# EAGLE design overview_mcu_dev (EAGLE 9.2.2)
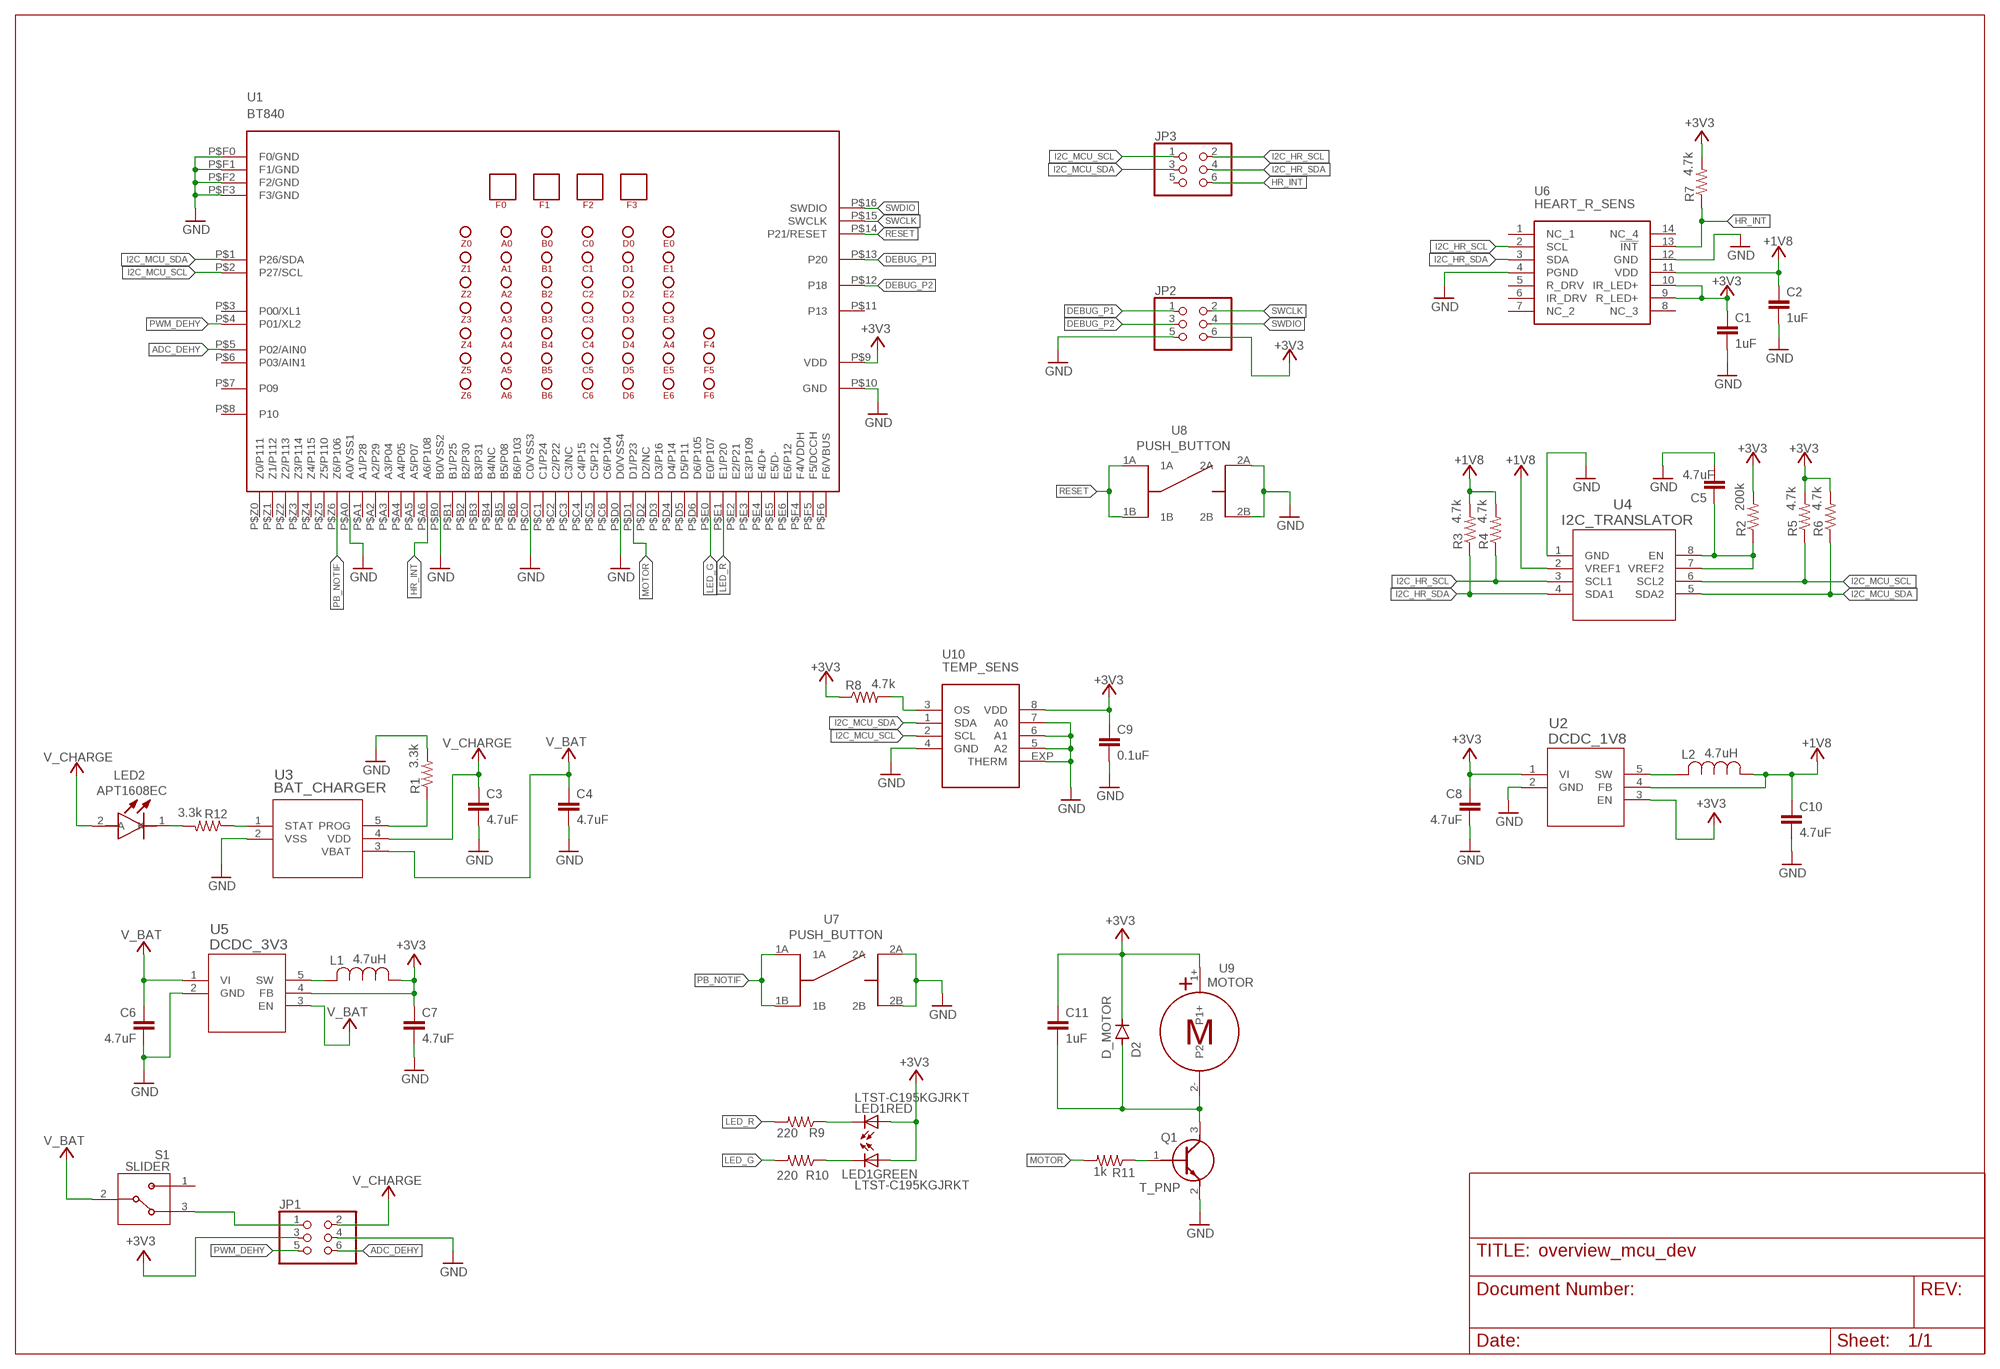
[diagram p0: schematic, sheet 1]

## Parts
C1  1uF  C-EUC0402K  [C0402K]
C2  1uF  C-EUC0402K  [C0402K]
C3  4.7uF  C-EUC0402K  [C0402K]
C4  4.7uF  C-EUC0402K  [C0402K]
C5  4.7uF  C-EUC0402K  [C0402K]
C6  4.7uF  C-EUC0402K  [C0402K]
C7  4.7uF  C-EUC0402K  [C0402K]
C8  4.7uF  C-EUC0402K  [C0402K]
C9  0.1uF  C-EUC0402K  [C0402K]
C10  4.7uF  C-EUC0402K  [C0402K]
C11  1uF  C-EUC0402K  [C0402K]
D2  D_MOTOR  CGRM4001-G  [SOD-123_MINI-SMA]
JP1  PINHD-2X3  [2X03]
JP2  PINHD-2X3  [2X03]
JP3  PINHD-2X3  [2X03]
L1  4.7uH  L_0604  [IND_1608]
L2  4.7uH  L_0604  [IND_1608]
LED1  LTST-C195KGJRKT  [LED-SMT]
LED2  APT1608EC  [LEDC1608X85N]
Q1  T_PNP  [SOT95P240X93-3N]
R1  3.3k  R-US_R0402  [R0402]
R2  200k  R-US_R0402  [R0402]
R3  4.7k  R-US_R0402  [R0402]
R4  4.7k  R-US_R0402  [R0402]
R5  4.7k  R-US_R0402  [R0402]
R6  4.7k  R-US_R0402  [R0402]
R7  4.7k  R-US_R0402  [R0402]
R8  4.7k  R-US_R0402  [R0402]
R9  220  R-US_R0402  [R0402]
R10  220  R-US_R0402  [R0402]
R11  1k  R-US_R0402  [R0402]
R12  3.3k  R-US_R0402  [R0402]
S1  SLIDER  [SW_CJS-1200TA]
U1  BT840  [BT840]
U2  DCDC_1V8  [DBV5]
U3  BAT_CHARGER  [SOT-23-5_MC]
U4  I2C_TRANSLATOR  [DQE8]
U5  DCDC_3V3  [DBV5]
U6  HEART_R_SENS  [MAX30102]
U7  PUSH_BUTTON  [PUSH_BUTTON]
U8  PUSH_BUTTON  [PUSH_BUTTON]
U9  MOTOR  [MOTOR]
U10  TEMP_SENS  [MAX30205]

## Nets
+1V8: C2.1 C10.1 L2.1 R3.2 R4.2 U2.4(FB) U4.2(VREF1) U6.11(VDD)
+3V3: C1.1 C7.1 C8.1 C9.1 C11.1 D2.C JP1.3 JP2.6 L1.1 LED1.P$1(GREEN:A) LED1.P$2(RED:A) R2.2 R5.2 R6.2 R7.2 R8.1 U1.P$9(VDD) U2.1(VI) U2.3(EN) U5.4(FB) U6.9(R_LED+) U6.10(IR_LED+) U9.1+ U10.8(VDD)
ADC_DEHY: JP1.6 U1.P$5(P02/AIN0)
DEBUG_P1: JP2.1 U1.P$13(P20)
DEBUG_P2: JP2.3 U1.P$12(P18)
GND: C1.2 C2.2 C3.2 C4.2 C5.2 C6.2 C7.2 C8.2 C9.2 C10.2 JP1.4 JP2.5 Q1.2(E) R1.2 U1.P$10(GND) U1.P$A0(A0/VSS1) U1.P$B0(B0/VSS2) U1.P$C0(C0/VSS3) U1.P$D0(D0/VSS4) U1.P$F0(F0/GND) U1.P$F1(F1/GND) U1.P$F2(F2/GND) U1.P$F3(F3/GND) U2.2(GND) U3.2(VSS) U4.1(GND) U5.2(GND) U6.4(PGND) U6.12(GND) U7.2A U7.2B U8.2A U8.2B U10.4(GND) U10.5(A2) U10.6(A1) U10.7(A0) U10.EXP(THERM)
HR_INT: JP3.6 R7.1 U1.P$A6(A6/P108) U6.13(!INT)
I2C_HR_SCL: JP3.2 R4.1 U4.3(SCL1) U6.2(SCL)
I2C_HR_SDA: JP3.4 R3.1 U4.4(SDA1) U6.3(SDA)
I2C_MCU_SCL: JP3.1 R5.1 U1.P$2(P27/SCL) U4.6(SCL2) U10.2(SCL)
I2C_MCU_SDA: JP3.3 R6.1 U1.P$1(P26/SDA) U4.5(SDA2) U10.1(SDA)
LED_G: R10.2 U1.P$E0(E0/P107)
LED_R: R9.2 U1.P$E1(E1/P20)
MOTOR: R11.2 U1.P$D1(D1/P23)
N$1: JP1.1 S1.3
N$2: R1.1 U3.5(PROG)
N$3: C5.1 R2.1 U4.7(VREF2) U4.8(EN)
N$4: L1.2 U5.5(SW)
N$5: L2.2 U2.5(SW)
N$6: LED1.P$4(RED:C) R9.1
N$7: R8.2 U10.3(OS)
N$8: LED1.P$3(GREEN:C) R10.1
N$9: R12.1 U3.1(STAT)
N$10: LED2.1(K) R12.2
N$11: C11.2 D2.A Q1.3(C) U9.2-
N$12: Q1.1(B) R11.1
PB_NOTIF: U1.P$Z6(Z6/P106) U7.1A U7.1B
PWM_DEHY: JP1.5 U1.P$4(P01/XL2)
RESET: U1.P$14(P21/RESET) U8.1A U8.1B
SWCLK: JP2.2 U1.P$15(SWCLK)
SWDIO: JP2.4 U1.P$16(SWDIO)
V_BAT: C4.1 C6.1 S1.2 U3.3(VBAT) U5.1(VI) U5.3(EN)
V_CHARGE: C3.1 JP1.2 LED2.2(A) U3.4(VDD)
Unconnected: JP3.5 S1.1 U1.P$3(P00/XL1) U1.P$6(P03/AIN1) U1.P$7(P09) U1.P$8(P10) U1.P$11(P13) U1.P$A1(A1/P28) U1.P$A2(A2/P29) U1.P$A3(A3/P04) U1.P$A4(A4/P05) U1.P$A5(A5/P07) U1.P$B1(B1/P25) U1.P$B2(B2/P30) U1.P$B3(B3/P31) U1.P$B4(B4/NC) U1.P$B5(B5/P08) U1.P$B6(B6/P103) U1.P$C1(C1/P24) U1.P$C2(C2/P22) U1.P$C3(C3/NC) U1.P$C4(C4/P15) U1.P$C5(C5/P12) U1.P$C6(C6/P104) U1.P$D2(D2/NC) U1.P$D3(D3/P16) U1.P$D4(D4/P14) U1.P$D5(D5/P11) U1.P$D6(D6/P105) U1.P$E2(E2/P21) U1.P$E3(E3/P109) U1.P$E4(E4/D+) U1.P$E5(E5/D-) U1.P$E6(E6/P12) U1.P$F4(F4/VDDH) U1.P$F5(F5/DCCH) U1.P$F6(F6/VBUS) U1.P$Z0(Z0/P111) U1.P$Z1(Z1/P112) U1.P$Z2(Z2/P113) U1.P$Z3(Z3/P114) U1.P$Z4(Z4/P115) U1.P$Z5(Z5/P110) U6.1(NC_1) U6.5(R_DRV) U6.6(IR_DRV) U6.7(NC_2) U6.8(NC_3) U6.14(NC_4)

## Library data of the parts
C1-C11 = resistor:C-EU: CAPACITOR, European symbol
D2 = diode:CGRM400*-G: Molded plasitc,JEDEC SOD-123/Mini SMA Source: Comchip CGRM4001-G.pdf
JP1-JP3 = pinhead:PINHD-2X3: PIN HEADER
L1 L2 = L_0604:L_0604; MANUFACTURER_PART_NUMBER: GLFR1608T4R7MLR; VENDOR: TDK
LED1 = Led_LTST-C195KGJRKT:LTST-C195KGJRKT; DESCRIPTION: LED GREEN/RED CLEAR CHIP SMD; LINK: https://www.digikey.com/product-detail/en/lite-on-inc/LTST-C195KGJRKT/160-1452-1-ND/386846; MANUFACTURER: Lite-On Inc.; MANUFACTURER_PART_NUM: LTST-C195KGJRKT
LED2 = LED_APT1608EC:APT1608EC: Standard LEDs - SMD HI EFF RED WTR CLR Source: Datasheet <http://docs-emea.rs-online.com/webdocs/142e/0900766b8142ead4.pdf>; DESCRIPTION: LED RED CLEAR CHIP SMD; LINK: https://www.digikey.com/product-detail/en/kingbright/APT1608EC/754-1117-1-ND/1747834; MANUFACTURER: Kingbright; MANUFACTURER_PART_NUM: APT1608EC
Q1 = transistor:T_PNP: Transistor GP BJT NPN 40V 0.2A SOT23 Fairchild MMBT3904 NPN Bipolar Transistor, 0.2 A, 40 V, 3-Pin SOT-23 Source: Datasheet <https://www.fairchildsemi.com/datasheets/MM/MMBT3904.pdf>; DESCRIPTION: TRANS NPN 40V 0.2A SOT23; LINK: https://www.digikey.com/products/en?keywords=MMBT3904TPMSCT; MANUFACTURER: Micro Commercial Co; MANUFACTURER_PART_NUM: MMBT3904-TP
R1-R12 = resistor:R-US_: RESISTOR, American symbol
S1 = slider:SLIDER: Switch Slide N.O./N.C. SPDT Raised Slide 0.1A 24VDC J-Hook SMD Embossed T/R; DESCRIPTION: SWITCH SLIDE SPDT 100MA 6V; LINK: https://www.digikey.com/product-detail/en/nidec-copal-electronics/CJS-1200TA/563-1021-1-ND/948401; MANUFACTURER: Nidec Copal Electronics; MANUFACTURER_PART: CJS-1200TA
U1 = Nrf52_BT840:BT840; DESCRIPTION: NRF52840 BLUETOOTH 5, THREAD, ZI; LINK: https://www.fanstel.com/bt840f-nrf52840-ble-5-module-secure-iot-802154-thread-zigbee; MANUFACTURER: Fanstel; MANUFACTURER_PART_NUM: BT840
U2 = DCDC_1V8_TPS62202DBVR:DCDC_1V8; DESCRIPTION: IC REG BUCK 1.8V 0.3A SYNC SOT23; LINK: https://www.digikey.com/product-detail/en/texas-instruments/TPS62202DBVR/296-16730-1-ND/616311; MANUFACTURER: Texas Instruments; MANUFACTURER_PART_NUM: TPS62202DBVR
U3 = BatManager_MCP73831:BAT_CHARGER; DESCRIPTION: IC CONTROLLR LI-ION 4.2V SOT23-5; LINK: https://www.digikey.com/product-detail/en/microchip-technology/MCP73831T-2ACI-OT/MCP73831T-2ACI-OTCT-ND/1979802; MANUFACTURER: Microchip; MANUFACTURER_PART_NUM: MCP73831T2ACIOT
U4 = I2Ctranslator_PCA9306DQER:I2C_TRANSLATOR; DESCRIPTION: IC TRNSLTR BIDIRECTIONAL 8X2SON; LINK: https://www.digikey.com/product-detail/en/texas-instruments/PCA9306DQER/296-27957-1-ND/2446266; MANUFACTURER: Texas Instruments; MANUFACTURER_PART_NUM: PCA9306DQER
U5 = DCDC_3V3_TPS62203DBVR:DCDC_3V3; DESCRIPTION: IC REG BUCK 3.3V 0.3A SYNC SOT23; LINK: https://www.digikey.com/product-detail/en/texas-instruments/TPS62203DBVR/296-39452-1-ND/5143400; MANUFACTURER: Texas Instruments; MANUFACTURER_PART_NUM: TPS62203DBVR
U6 = heartRate_max30102:HEART_R_SENS; DESCRIPTION: IC SENSOR OXIMETER/HEARTRATE; LINK: https://www.digikey.com/product-detail/en/maxim-integrated/MAX30102EFD/MAX30102EFD-ND/6166869; MANUFACTURER: Maxim Integrated; MANUFACTURER_PART_NUM: MAX30102EFD+
U7 U8 = push_button:PUSH_BUTTON; DESCRIPTION: SWITCH TACTILE SPST-NO 0.05A 12V; LINK: https://www.digikey.com/product-detail/en/panasonic-electronic-components/EVQ-P7A01P/P16763CT-ND/4429456; MANUFACTURER: Panasonic Electronic Components; MANUFACTURER_PART_NUM: EVQ-P7A01P
U9 = motor:MOTOR; DESCRIPTION: VIBRATION MOTOR CYL 2.7V SMD; LINK: https://www.digikey.com/product-detail/en/jinlong-machinery-electronics-inc/Z4FC1B1301781/1670-1011-1-ND/6009936; MANUFACTURER: Jinlong Machinery & Electronics, Inc.; MANUFACTURER_PART_NUM: Z4FC1B1301781
U10 = temp_max30205:TEMP_SENS; DESCRIPTION: SWITCH TACTILE SPST-NO 0.05A 12V; LINK: https://www.digikey.com/product-detail/en/panasonic-electronic-components/EVQ-P7A01P/P16763TR-ND/4429447; MANUFACTURER: Maxim Integrated; MANUFACTURER_PART_NUM: MAX30205MTA+

## Board
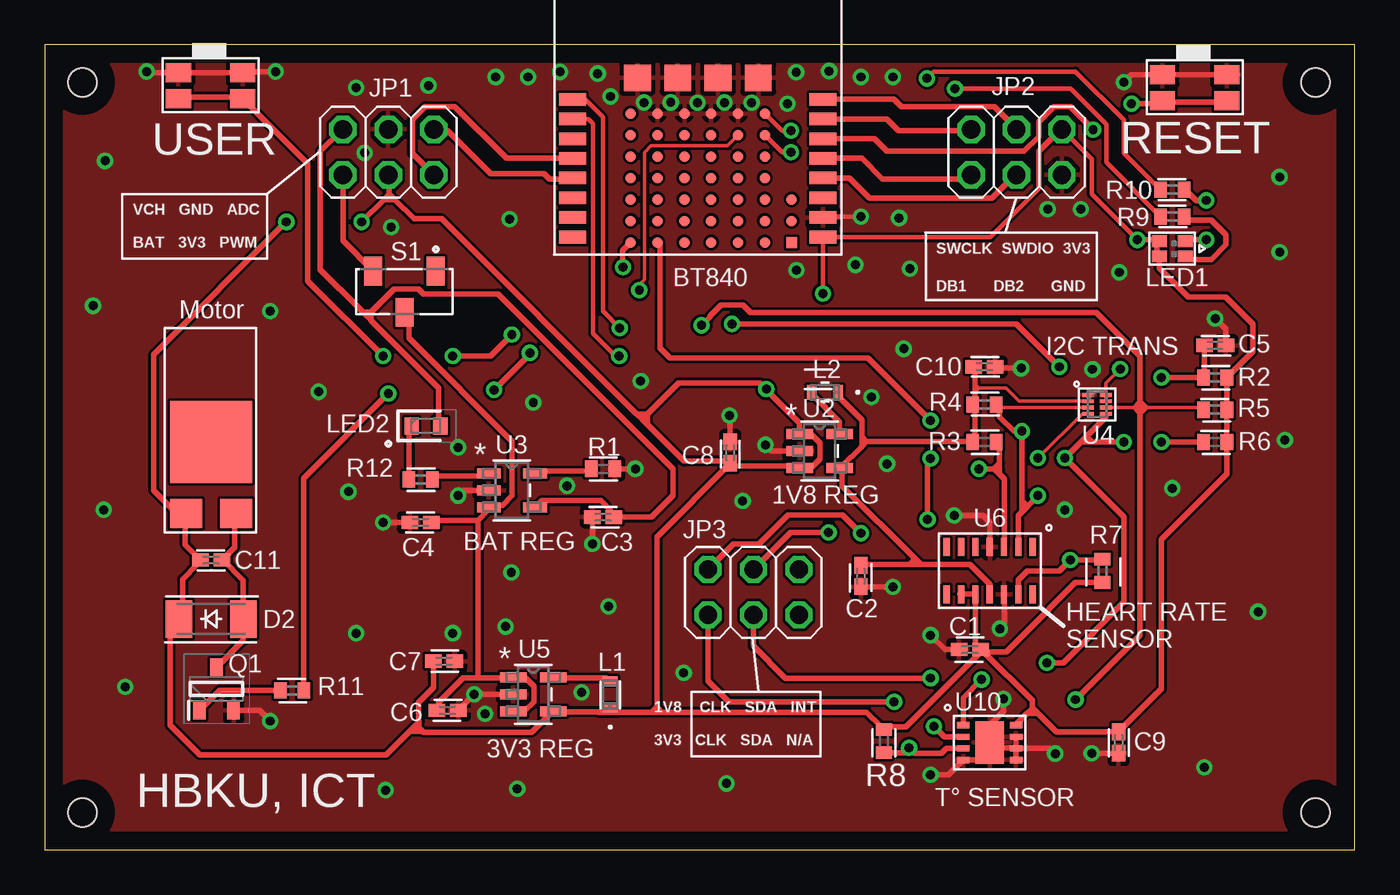
[diagram p1: board, top side]
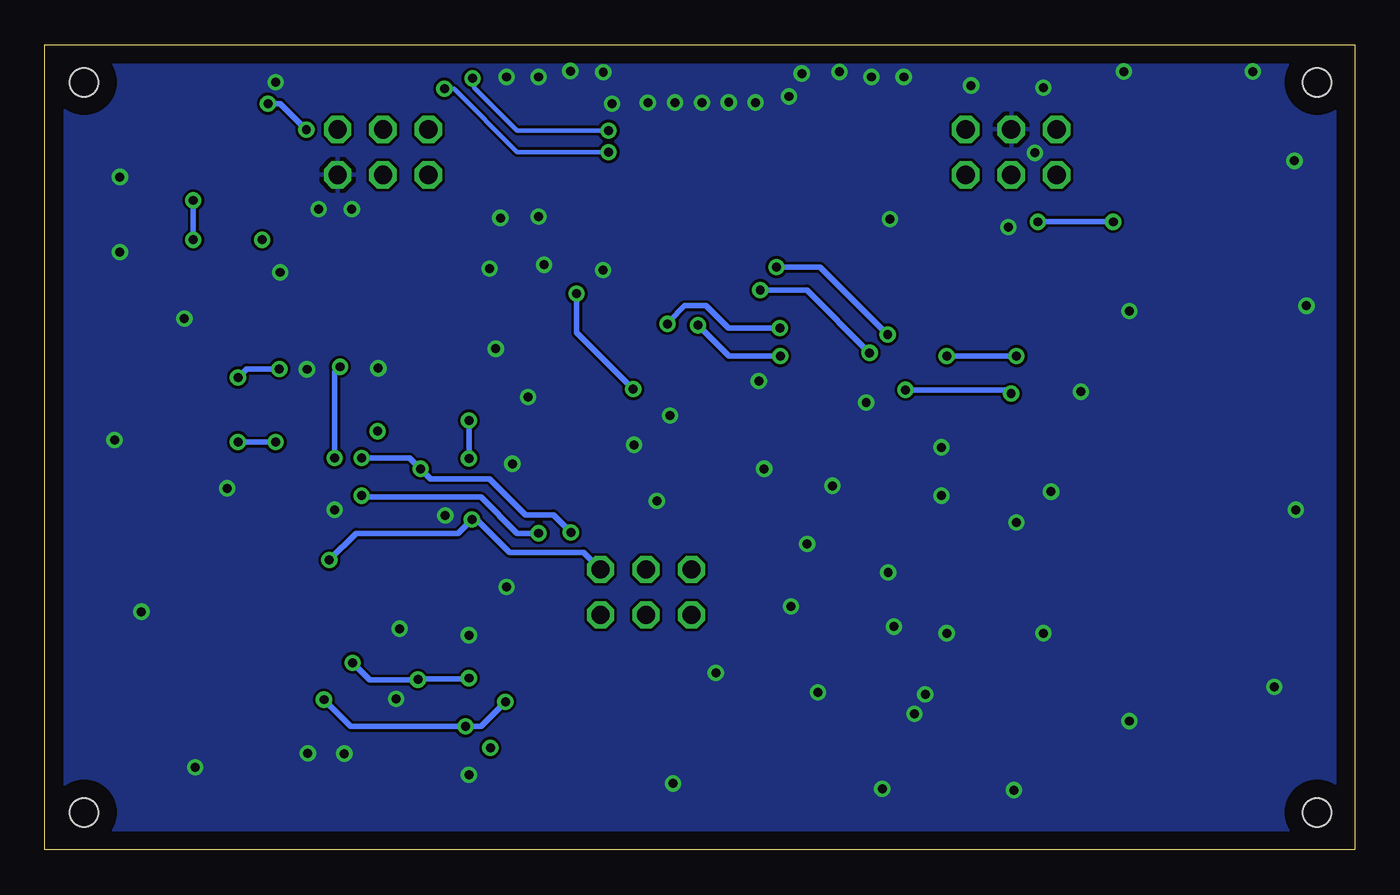
[diagram p2: board, bottom side, seen from below]

Size 73.2 x 45 mm. Coordinates in mm from the lower left corner, seen from the top.
Outline: 0,0 73.2,0 73.2,45 0,45 0,0
Copper layers (1*16): Top 0.035mm / dielectric 1.5mm / Bottom 0.035mm
Design rules "default *": minimum track width 0.15mm, minimum drill 0.5mm, track to track 6mil, track to pad 6mil, pad to pad 6mil, via to via 6mil, smd to smd 6mil, copper to edge 40mil, drill to drill 6mil, minimum pad ring 10mil, minimum via ring 8mil, stop-mask expansion 6mil, vias tented up to drill 0mil, thermal gap 10mil
Holes 1.6 mm at 2.1,42.9 2.1,2.1 71,42.9 71,2.1

### Footprints (pad centres in the part's own frame; a part is rotated, then mirrored left to right if it is on the bottom)
C0402K = smd 0.925 x 0.74: 1 -0.6,0; 2 0.6,0
SOD-123_MINI-SMA = smd 1.5 x 2.1: A 1.8,0; C -1.8,0
2X03 = drill 1.016 octagon: 1 -2.54,-1.27; 2 -2.54,1.27; 3 0,-1.27; 4 0,1.27; 5 2.54,-1.27; 6 2.54,1.27
IND_1608 = smd 0.503 x 0.8: 1 -0.752,0; 2 0.752,0
LED-SMT = smd 0.65 x 0.85: P$1 0.425,0.725; P$2 -0.425,0.725; P$3 0.425,-0.725; P$4 -0.425,-0.725
LEDC1608X85N = smd 0.8 x 0.95: 1 -0.8,0; 2 0.8,0
SOT95P240X93-3N = smd 1 x 0.7: 1 -1.2,0.95; 2 -1.2,-0.95; 3 1.2,0
R0402 = smd 0.7 x 0.9: 1 -0.65,0; 2 0.65,0
SW_CJS-1200TA = smd 1 x 1.6: 1 -1.75,-1.15; 2 0,1.15; 3 1.75,-1.15
BT840 = smd 1.5 x 0.7: P$1 -7.112,3.847; P$2 -7.112,2.747; P$3 -7.112,1.647; P$4 -7.112,0.547; P$5 -7.112,-0.553; P$6 -7.112,-1.653; P$7 -7.112,-2.753; P$8 -7.112,-3.853; P$9 6.888,-3.853; P$10 6.888,-2.753; P$11 6.888,-1.653; P$12 6.888,-0.553; P$13 6.888,0.547; P$14 6.888,1.647; P$15 6.888,2.747; P$16 6.888,3.847 | smd 0.6 x 0.6: P$A0 -2.362,3.047; P$A1 -2.362,1.847; P$A2 -2.362,0.647; P$A3 -2.362,-0.553; P$A4 -2.362,-1.753; P$A5 -2.362,-2.953; P$A6 -2.362,-4.153; P$B0 -0.862,3.047; P$B1 -0.862,1.847; P$B2 -0.862,0.647; P$B3 -0.862,-0.553; P$B4 -0.862,-1.753; P$B5 -0.862,-2.953; P$B6 -0.862,-4.153; P$C0 0.638,3.047; P$C1 0.638,1.847; P$C2 0.638,0.647; P$C3 0.638,-0.553; P$C4 0.638,-1.753; P$C5 0.638,-2.953; P$C6 0.638,-4.153; P$D0 2.138,3.047; P$D1 2.138,1.847; P$D2 2.138,0.647; P$D3 2.138,-0.553; P$D4 2.138,-1.753; P$D5 2.138,-2.953; P$D6 2.138,-4.153; P$E0 3.638,3.047; P$E1 3.638,1.847; P$E2 3.638,0.647; P$E3 3.638,-0.553; P$E4 3.638,-1.753; P$E5 3.638,-2.953; P$E6 3.638,-4.153; P$F4 5.138,-1.753; P$F5 5.138,-2.953; P$F6 5.138,-4.153; P$Z0 -3.862,3.047; P$Z1 -3.862,1.847; P$Z2 -3.862,0.647; P$Z3 -3.862,-0.553; P$Z4 -3.862,-1.753; P$Z5 -3.862,-2.953; P$Z6 -3.862,-4.153 | smd 1.5 x 1.5: P$F0 -3.482,5.047; P$F1 -1.232,5.047; P$F2 1.018,5.047; P$F3 3.268,5.047
DBV5 = smd 1.473 x 0.559: 1 -1.118,0.95; 2 -1.118,0; 3 -1.118,-0.95; 4 1.118,-0.95; 5 1.118,0.95
SOT-23-5_MC = smd 1.321 x 0.559: 1 -1.295,0.95; 2 -1.295,0; 3 -1.295,-0.95; 4 1.295,-0.95; 5 1.295,0.95
DQE8 = smd 0.66 x 0.203: 1 -0.495,0.525; 2 -0.495,0.175; 3 -0.495,-0.175; 4 -0.495,-0.525; 5 0.495,-0.525; 6 0.495,-0.175; 7 0.495,0.175; 8 0.495,0.525
MAX30102 = smd 1 x 0.35: 1 -1.325,2.4; 2 -1.325,1.6; 3 -1.325,0.8; 4 -1.325,0; 5 -1.325,-0.8; 6 -1.325,-1.6; 7 -1.325,-2.4; 8 1.325,-2.4; 9 1.325,-1.6; 10 1.325,-0.8; 11 1.325,0; 12 1.325,0.8; 13 1.325,1.6; 14 1.325,2.4
PUSH_BUTTON = smd 1.4 x 1.05: 1A -1.859,0.721; 1B 1.741,0.721; 2A -1.859,-0.729; 2B 1.741,-0.729
MOTOR = smd 1.8 x 1.6: 1+ -1.402,-3.996; 2- 1.4,-3.996 | smd 4.6 x 4.6: 3 0,0
MAX30205 = smd 0.7 x 0.35: 1 -1.475,0.975; 2 -1.475,0.325; 3 -1.475,-0.325; 4 -1.475,-0.975; 5 1.475,-0.975; 6 1.475,-0.325; 7 1.475,0.325; 8 1.475,0.975 | smd 1.58 x 2.35: EXP 0,0

### Placement (x,y rotation side)
C1  51.69,11.2 180 top
C2  45.6,15.3 270 top
C3  31.2,18.6 180 top
C4  21,18.3 180 top
C5  65.4,28.2 0 top
C6  22.5,7.8 0 top
C7  22.31,10.55 0 top
C8  38.3,22.2 90 top
C9  60,6 270 top
C10  52.5,27 0 top
C11  9.3,16.2 0 top
D2  9.3,12.9 0 top
JP1  19.2,39 0 top
JP2  54.3,39 0 top
JP3  39.6,14.4 0 top
L1  31.6,8.7 90 top
L2  43.6,25.58 180 top
LED1  63,33.6 90 top
LED2  21.3,23.7 0 top
Q1  9.6,9 90 top
R1  31.2,21.3 0 top
R2  65.4,26.4 0 top
R3  52.5,22.8 180 top
R4  52.5,24.9 180 top
R5  65.4,24.6 0 top
R6  65.4,22.8 0 top
R7  59.1,15.6 270 top
R8  46.89,6.08 270 top
R9  63,35.4 180 top
R10  63,36.9 180 top
R11  13.82,8.92 0 top
R12  21,20.7 180 top
S1  20.1,31.2 180 top
U1  36.6,38.1 0 top
U2  43.3,22.3 0 top
U3  26.1,20.1 0 top
U4  58.8,24.9 0 top
U5  27.3,8.7 0 top
U6  52.8,15.6 270 top
U7  9.21,42.71 180 top
U8  64.2,42.6 180 top
U9  9.3,22.8 0 top
U10  52.8,6 0 top

### Tracks (layer width: path | path; a pad name or v marks a point on that pad's centre or on a via)
+1V8
  Top 0.2: 51.98,26.1 51.98,26.02 52.2,25.8 51.98,25.57 51.98,25.55
  Top 0.203: 51.98,25.8 52.2,25.8 53.7,25.8 54.42,25.08 57.86,25.08 57.86,25.07 U4.2
  Top 0.3: C10.1 51.98,26.95 51.98,26.1 51.98,25.8 51.98,25.55 51.98,25.02 R4.2 51.98,24.75 51.98,22.82 R3.2 51.7,22.82 45.9,22.82 45.65,22.82 | 45.65,22.82 45.65,22.55 45.6,22.5 44.55,21.45 U2.4 44.55,21.18 44.55,20.35 48.65,16.25 48.95,15.95 | 45.65,22.82 45.65,23.1 45.65,24.04 | U6.11 52.8,14.85 51.7,15.95 48.95,15.95 | C2.1 45.65,15.95 48.3,15.95 48.95,15.95
  Top 0.305: 48.3,15.95 48.35,15.95 48.65,16.25 | 45.65,23.1 45.9,22.85 45.9,22.82 45.9,22.8 45.6,22.5 | 45.65,24.04 44.35,25.34 L2.1
+3V3  (via drill 0.5)
  Top 0.254: v43.48,31.09 v43.49,31.1 U1.P$9 52.85,34.25 55.55,36.95 55.55,37.12 | v61.05,34.1 58.5,36.65 58.5,38.61 JP2.6
  Top 0.3: C8.1 38.5,21.45 42.08,21.45 U2.3 42.21,21.38 42.84,21.38 43.32,21.86 43.32,22.75 42.81,23.25 U2.1 42.18,23.87 40.23,25.82 40.25,25.82 v40.32,25.75 39.97,26.1 35.4,26.1 33.67,24.38 | 33.67,23.77 35.73,21.73 38.23,21.73 C8.1 | 33.67,23.77 33.38,24.07 | 33.38,24.07 33.08,24.38 | 33.08,24.38 22.18,35.27 20.62,35.27 19.55,36.35 | JP1.3 19.25,37.67 19.25,36.65 | 7.97,18.7 U9.1+ 7.37,18.8 6.1,20.07 6.1,27.7 v13.5,35.1 | C11.1 8.53,15.95 7.7,15.12 7.7,12.93 D2.C 7.07,12.47 7,12.24 7,6.97 8.65,5.33 19.07,5.33 20.38,6.62 | 20.9,7.2 20.9,7.15 20.75,7 | 20.9,7.2 20.9,8.25 21.73,9.07 21.73,10.55 C7.1 | 21.12,6.62 20.93,6.83 | 20.93,6.83 20.75,7 | 20.75,7 20.38,6.62 | 55.55,37.12 55.55,39.05 56.65,40.15 JP2.6 | U6.9 51.15,14.3 51.98,14.3 U6.10 51.99,14.2 | 48.12,6.88 47.02,6.88 R8.1 46.75,6.88 45.92,7.7 34.5,7.7 | 55.17,7.95 55.49,7.62 | 55.49,7.62 56.52,6.6 C9.1 62.4,9 62.4,17.35 66.05,21 R6.2 R5.2 R2.2 67.5,27.85 67.5,29.4 66,30.9 63.9,30.9 62.27,32.52 LED1.P$2 62.15,33.27 62.15,33.83 LED1.P$1 62.15,34.1 v61.05,34.1 | 34.5,7.7 34.2,7.7 | 34.2,7.7 33.9,7.7 | 33.9,7.7 32.1,7.7 31.62,7.7 L1.1 31.36,7.71 30.9,7.71 28.46,7.71 U5.4 28.32,7.7 27.2,6.58 21.18,6.58 21.12,6.62 | v17.7,35.1 18.95,36.35 | 18.95,36.35 19.25,36.65 | 54.67,12.02 57.6,14.95 R7.2 | 54.88,7.62 54.27,7.03 U10.8 | 54.88,7.62 55.17,7.92 55.17,7.95 | 55.17,7.95 55.17,8.35 | 19.55,36.35 19.25,36.65 | 19.55,36.35 18.95,36.35 | 55.49,7.62 54.88,7.62 | 20.93,6.83 20.93,7.17 20.9,7.2 | 21.12,6.62 20.38,6.62 | 33.67,24.38 33.38,24.07 | 33.67,23.77 33.67,24.38 | 33.08,24.38 33.67,24.38 | C8.1 34.2,17.5 34.2,8 | 34.2,8 34.2,7.7 | 34.5,7.7 34.2,8
  Top 0.3: 33.9,7.7 34.2,8
  Top 0.305: C11.1 7.85,17.05 7.85,18.57 7.97,18.7 | 30.9,7.71 30.91,7.7 32.1,7.7 | 54.67,12.02 53.73,11.08 52.44,11.08 | C1.1 52.41,11.08 52.44,11.08 | 55.17,8.35 52.44,11.08 | C1.1 51.99,11.5 51.99,14.2 | 48.12,6.88 52.29,11.04 C1.1
  Bottom 0.3: v43.48,31.09 43.48,28.91 v40.32,25.75 | v13.5,35.1 v17.7,35.1
ADC_DEHY
  Top 0.3: JP1.6 21.81,40.2 22.5,40.2 24.9,37.8 27.9,37.8 28.2,37.5 29.44,37.5 U1.P$5
DEBUG_P1
  Top 0.3: JP2.1 51.7,37.68 51.52,37.5 46.8,37.5 45.65,38.65 U1.P$13
DEBUG_P2
  Top 0.3: JP2.3 54.17,37.67 52.93,36.43 46.07,36.43 44.95,37.55 U1.P$12
GND  (via drill 0.5)
  Top 0.254: U1.P$10 43.54,35.4 v45.6,35.4
  Top 0.3: v12.9,43.5 11.13,43.5 U7.2A U7.2B 5.76,43.44 v5.7,43.5 | C4.2 v18.9,18.3 | U3.2 23.4,20.1 v23.1,19.8 | C3.2 v30.6,17.1 | R1.2 v33,21.3 | C8.2 38.3,24.24 v38.26,24.28 | U2.2 40.61,22.3 v40.27,22.64 | U6.4 52.8,18.3 52.41,18.69 v50.82,18.69 | U6.12 53.61,14.27 53.61,12.6 v53.37,12.36 | U10.7 U10.6 | U10.6 U10.5 | U10.6 56.16,5.67 v56.46,5.38 | v53.57,8.44 53.57,7.75 52.8,6.98 U10.EXP 52.8,5.7 52.8,5.4 52.42,5.03 U10.4 50.5,4.2 v49.5,4.2 | C6.2 v24,8.7 U5.2 | Q1.2 12,7.8 v12.6,7.2 | C9.2 v58.5,5.4 | v54.56,26.92 53.18,26.92 C10.2 | C2.2 v47.4,14.7 | C5.2 66,29.1 v65.4,29.7 | U8.2A U8.2B 60.73,43.33 v60.3,42.9
  Top 0.305: U10.6 54.25,5.7 52.8,5.7 | C1.2 50.3,11.2 v49.5,12
  other vias: 17.4,42.6 21.44,42.72 15.3,25.61 16.97,20.02 17.4,12.11 31.5,13.61 27.3,25.01 47.07,21.58 48,28.01 46.2,25.31 48.35,32.49 60.04,32.28 3.37,38.51 2.7,30.41 4.5,9.11 19.05,3.34 26.4,3.41 38.1,3.71 64.8,4.61 67.8,13.31 69.3,22.91 69,33.41 58.55,26.86 57,19.01 63,20.21 17.88,38.96 19.35,34.81 30.9,43.39 28.8,43.48 27,43.2 25.2,43.2 41.99,43.46 43.83,43.53 45.6,43.2 47.4,43.2 41.5,41.71 31.62,42.11 33.49,41.77 34.98,41.78 36.48,41.76 37.98,41.77 39.5,41.76 42,32.4 45.3,32.7 47.74,35.32 30,8.81 24.6,7.61 22.8,12.11 29.18,20.35 25.75,12.48 23.1,22.5 26.07,15.51 39,19.5 35.7,9.9 56.04,35.81 57.9,35.81 25.97,35.26 12.6,30.11 33.3,26.21 69,37.61 3.3,19.01
  pour Bottom: 0.53,0.6 0.53,44.44 72.6,44.44 72.6,0.6
  pour Top: 0.3,0.3 0.3,44.7 72.9,44.7 72.9,0.3
HR_INT  (via drill 0.5)
  Top 0.3: U1.P$A6 34.37,33.81 34.37,28.05 34.92,27.5 46,27.5 v49.5,24 | v49.5,21.88 49.33,21.71 v49.33,18.47 | R7.1 59.05,16.2 v57.3,16.2
  Top 0.305: U6.13 54.4,15.1 54.9,15.6 56.7,15.6 v57.3,16.2
  Bottom 0.3: v57.3,16.2 55.8,17.7 50.1,17.7 v49.33,18.47 49.07,18.47 47.23,16.63 43.1,16.63 JP3.6 | v49.5,21.88 v49.5,24
I2C_HR_SCL  (via drill 0.5)
  Top 0.152: 53.33,24.73 R4.1
  Top 0.203: U4.3 53.33,24.73
  Top 0.3: R4.1 53.35,24.75 53.35,24.2 54.15,23.4 v54.6,23.4 54.6,19.5 | 54.6,19.5 54.6,18.9 | U6.2 54.4,18.7 54.6,18.9 | v55.5,19.8 54.9,19.2 | 54.9,19.2 54.6,18.9 | 54.6,19.5 54.9,19.2 | JP3.2 38.49,17.1 39.9,17.1 41.53,18.73 44.57,18.73 v45.6,17.7
  Bottom 0.3: v45.6,17.7 46.8,17.7 48.82,19.72 55.45,19.72 55.45,19.75 v55.5,19.8
I2C_HR_SDA  (via drill 0.5)
  Top 0.203: U4.4 57.98,24.38 v55.5,21.9
  Top 0.3: 53.35,21 53.35,21.3 | 53.35,21.3 53.35,21.6 | 53.35,21.6 53.35,22.55 R3.1 | v52.2,21.3 53.1,21.3 | 53.1,21.3 53.35,21.3 | 53.35,21 53.62,20.73 | 53.35,21 53.1,21.25 53.1,21.3 | 53.1,21.3 53.1,21.35 53.35,21.6 | JP3.4 41.67,17.74 v43.8,17.74
  Top 0.305: 53.62,20.73 53.62,16.95 U6.3
  Bottom 0.3: v55.5,21.9 52.8,21.9 v52.2,21.3 51.64,20.74 48.34,20.74 46.32,18.72 44.78,18.72 v43.8,17.74
I2C_MCU_SCL  (via drill 0.5)
  Top 0.152: R5.1 64.62,24.73
  Top 0.203: 64.62,24.73 61.5,24.73 61.2,24.73 60.9,24.73 U4.6
  Top 0.254: U1.P$2 30.38,40.85 30.65,40.58 30.65,28.85 31.9,27.6 v32.1,27.6
  Top 0.3: 61.2,25.02 61.2,24.73 61.2,24.43 | v36.7,29.32 37.16,29.78 37.16,29.83 37.79,30.46 39.01,30.46 39.43,30.04 58.76,30.04 61.2,27.6 61.2,25.02 | v49.69,6.91 50.27,6.33 U10.2 | v57.6,8.4 61.2,12 61.2,24.43 | 61.2,24.43 61.5,24.73 61.2,25.02 | 61.2,24.43 60.9,24.73 61.2,25.02 | JP3.1 37.06,9.44 38.22,8.28 v47.46,8.28
  Bottom 0.3: v32.1,27.6 34.98,27.6 v36.7,29.32 | v57.6,8.4 56.11,6.91 v49.69,6.91 48.83,6.91 v47.46,8.28
I2C_MCU_SDA  (via drill 0.5)
  Top 0.15: U4.5 59.3,24.2
  Top 0.254: U1.P$1 30.19,41.95 31.19,40.95 31.19,30.11 v32.13,29.17
  Top 0.3: v38.4,29.4 54.3,29.4 v56.7,27 | U10.1 51.33,8.49 v52.35,9.52 | v56,10.46 56.91,10.46 60.3,13.85 60.3,18.6 v57,21.9 | 57.3,21.6 v57,21.9 | JP3.3 39.6,11.4 41.4,9.6 v49.5,9.6 | 57.9,22.8 v57,21.9 | 58.5,22.8 57.9,22.8 | 57.9,22.8 58.2,23.1 58.5,22.8 | 58.5,22.8 58.51,22.79 v60.3,22.79 | v62.4,22.8 R6.1
  Top 0.305: 58.2,23.1 59.3,24.2 59.3,24.32
  Bottom 0.3: v32.13,29.17 34.99,29.17 36.24,30.42 37.44,30.42 38.3,29.56 38.3,29.5 v38.4,29.4 | v56.7,27 57,26.7 v57,21.9 | v56,10.46 55.05,9.51 v52.36,9.51 v52.35,9.52 52.3,9.57 49.53,9.57 v49.5,9.6 | v62.4,22.8 v62.39,22.79 v60.3,22.79
LED_G  (via drill 0.5)
  Top 0.254: U1.P$E0 41.19,40.2 v41.7,40.2 | v49.3,43.12 49.68,43.5 57.6,43.5 60.3,40.8 60.3,38.95 R10.2
  Bottom 0.254: v41.7,40.2 46.8,40.2 49.2,42.6 49.2,43.02 v49.3,43.12
LED_R  (via drill 0.5)
  Top 0.254: U1.P$E1 41.19,39 v41.7,39 | R9.2 59.31,38.44 59.31,40.55 57.33,42.54 v50.87,42.54
  Bottom 0.254: v41.7,39 46.8,39 50.34,42.54 v50.87,42.54
MOTOR  (via drill 0.5)
  Top 0.2: U1.P$D1 38.14,39.35 33.87,39.35 33.5,38.98 33.5,31.87 33.22,31.59 v33.22,31.29
  Top 0.305: v27.11,27.78 27.11,27.71 25.69,26.29 25.68,26.29 v25.1,25.71 | v19.2,25.5 14.47,20.77 R11.2
  Bottom 0.305: v33.22,31.29 30.62,31.29 v27.11,27.78 | v25.1,25.71 19.41,25.71 v19.2,25.5
N$1
  Top 0.3: S1.3 16.66,34.04 JP1.1
N$2
  Top 0.3: R1.1 30.52,21.18 27.5,21.18 U3.5
N$3  (via drill 0.5)
  Top 0.203: v60.09,26.88 59.3,26.09 U4.8 U4.7
  Top 0.3: C5.1 64.8,26.45 R2.1 v62.4,26.4
  Bottom 0.3: v62.4,26.4 61.92,26.88 v60.09,26.88
N$4
  Top 0.3: L1.2 31.35,9.62 28.6,9.62 U5.5
N$5
  Top 0.3: L2.2 42.87,25.56 42.87,25.46
  Top 0.305: U2.5 44.42,23.91 42.87,25.46
N$6
  Top 0.3: LED1.P$4 63.8,33 65.17,33 66,33.83 66,34.38 65.17,35.2 63.8,35.2 R9.1
N$7  (via drill 0.5)
  Top 0.3: R8.2 48.03,5.43 v48.3,5.7 48.6,5.4 50.1,5.4 50.38,5.67 U10.3
N$8  (via drill 0.5)
  Top 0.3: v64.9,34.1 63.8,34.1 LED1.P$3 | v64.9,36.3 64.35,36.3 63.8,36.85 R10.1
  Bottom 0.3: v64.9,36.3 v64.9,34.1
N$9
  Top 0.3: R12.1 21.73,20.9 24.75,20.9 U3.1
N$10
  Top 0.3: R12.2 20.35,23.65 LED2.1
N$11
  Top 0.3: C11.2 9.93,16.23 10.6,16.9 10.6,18.76 U9.2-
  Top 0.305: 9.93,16.23 11.1,15.06 D2.A 11.1,11.7 Q1.3
N$12
  Top 0.3: Q1.1 9.78,8.93 R11.1
PB_NOTIF  (via drill 0.5)
  Top 0.3: U7.1B 7.7,42.08 11,42.08 U7.1A 14.7,38.36 14.7,31.8 v18.9,27.6 | v32.31,32.57 32.3,32.58 32.3,33.51 U1.P$Z6 | v26.1,28.8 24.9,27.6 v22.8,27.6
  Bottom 0.3: v26.1,28.8 29.87,32.57 v32.31,32.57 | v18.9,27.6 v22.8,27.6
PWM_DEHY
  Top 0.305: JP1.5 20.55,38.92 20.55,40.84 21.26,41.55 22.9,41.55 25.8,38.65 U1.P$4
RESET  (via drill 0.5)
  Top 0.3: U8.1A 66,41.8 62.7,41.8 U8.1B 62.28,41.7 v60.73,41.7 | v58.58,40.25 57.3,41.52 56.38,41.52 55.55,40.7 55.55,39.88 54.73,39.05 47.05,39.05 46.35,39.75 U1.P$14
  Bottom 0.3: v60.73,41.7 60.03,41.7 v58.58,40.25
SWCLK
  Top 0.3: U1.P$15 47.05,40.85 47.7,40.2 51.69,40.2 JP2.2
SWDIO
  Top 0.3: JP2.4 54.17,40.42 53.08,41.52 47.88,41.52 47.45,41.95 U1.P$16
V_BAT
  Top 0.3: 24.2,9.62 26.12,9.62 U5.1 | 24.2,9.62 23.38,9.62 22,8.25 22,7.97 C6.1 | 24.2,18.43 21.73,18.43 C4.1 | 24.2,18.43 24.75,18.98 U3.3 25.02,19.25 25.57,19.25 26.12,19.8 26.12,22.82 20.35,28.6 20.35,29.98 S1.2 | 24.2,18.43 24.2,9.62
  Top 0.305: U5.1 26.21,9.62 26.86,9.62 27.34,9.14 27.34,8.28 26.77,7.71 26.23,7.71 U5.3
V_CHARGE
  Top 0.3: U3.4 27.5,19.25 27.77,19.52 31.07,19.52 31.62,18.98 31.62,18.7 C3.1 33.9,18.6 35.1,19.8 35.1,21.3 25.32,31.07 21.18,31.07 20.9,31.35 19.52,31.35 18.24,30.06 18,29.82 | 18,29.82 17.61,30.21 15.4,32.42 15.4,39.05 16.5,40.15 JP1.2 | 18,29.82 18.36,29.46 22,25.82 22,23.93 LED2.2
  Top 0.305: 18.36,29.46 18.24,29.59 18.24,30.06 17.76,30.06 17.61,30.21

### Text on the board
tPlace: USER | RESET | VCH GND ADC / / BAT 3V3 PWM | SWCLK SWDIO 3V3 | BT840 | LED1 | DB1 DB2 GND | Motor | I2C TRANS | 1V8 REG | BAT REG | HEART RATE / SENSOR | 1V8 CLK SDA INT / / 3V3 CLK SDA N/A | 3V3 REG | HBKU, ICT | T° SENSOR